# Altium project 线性稳压电源.PrjPCB
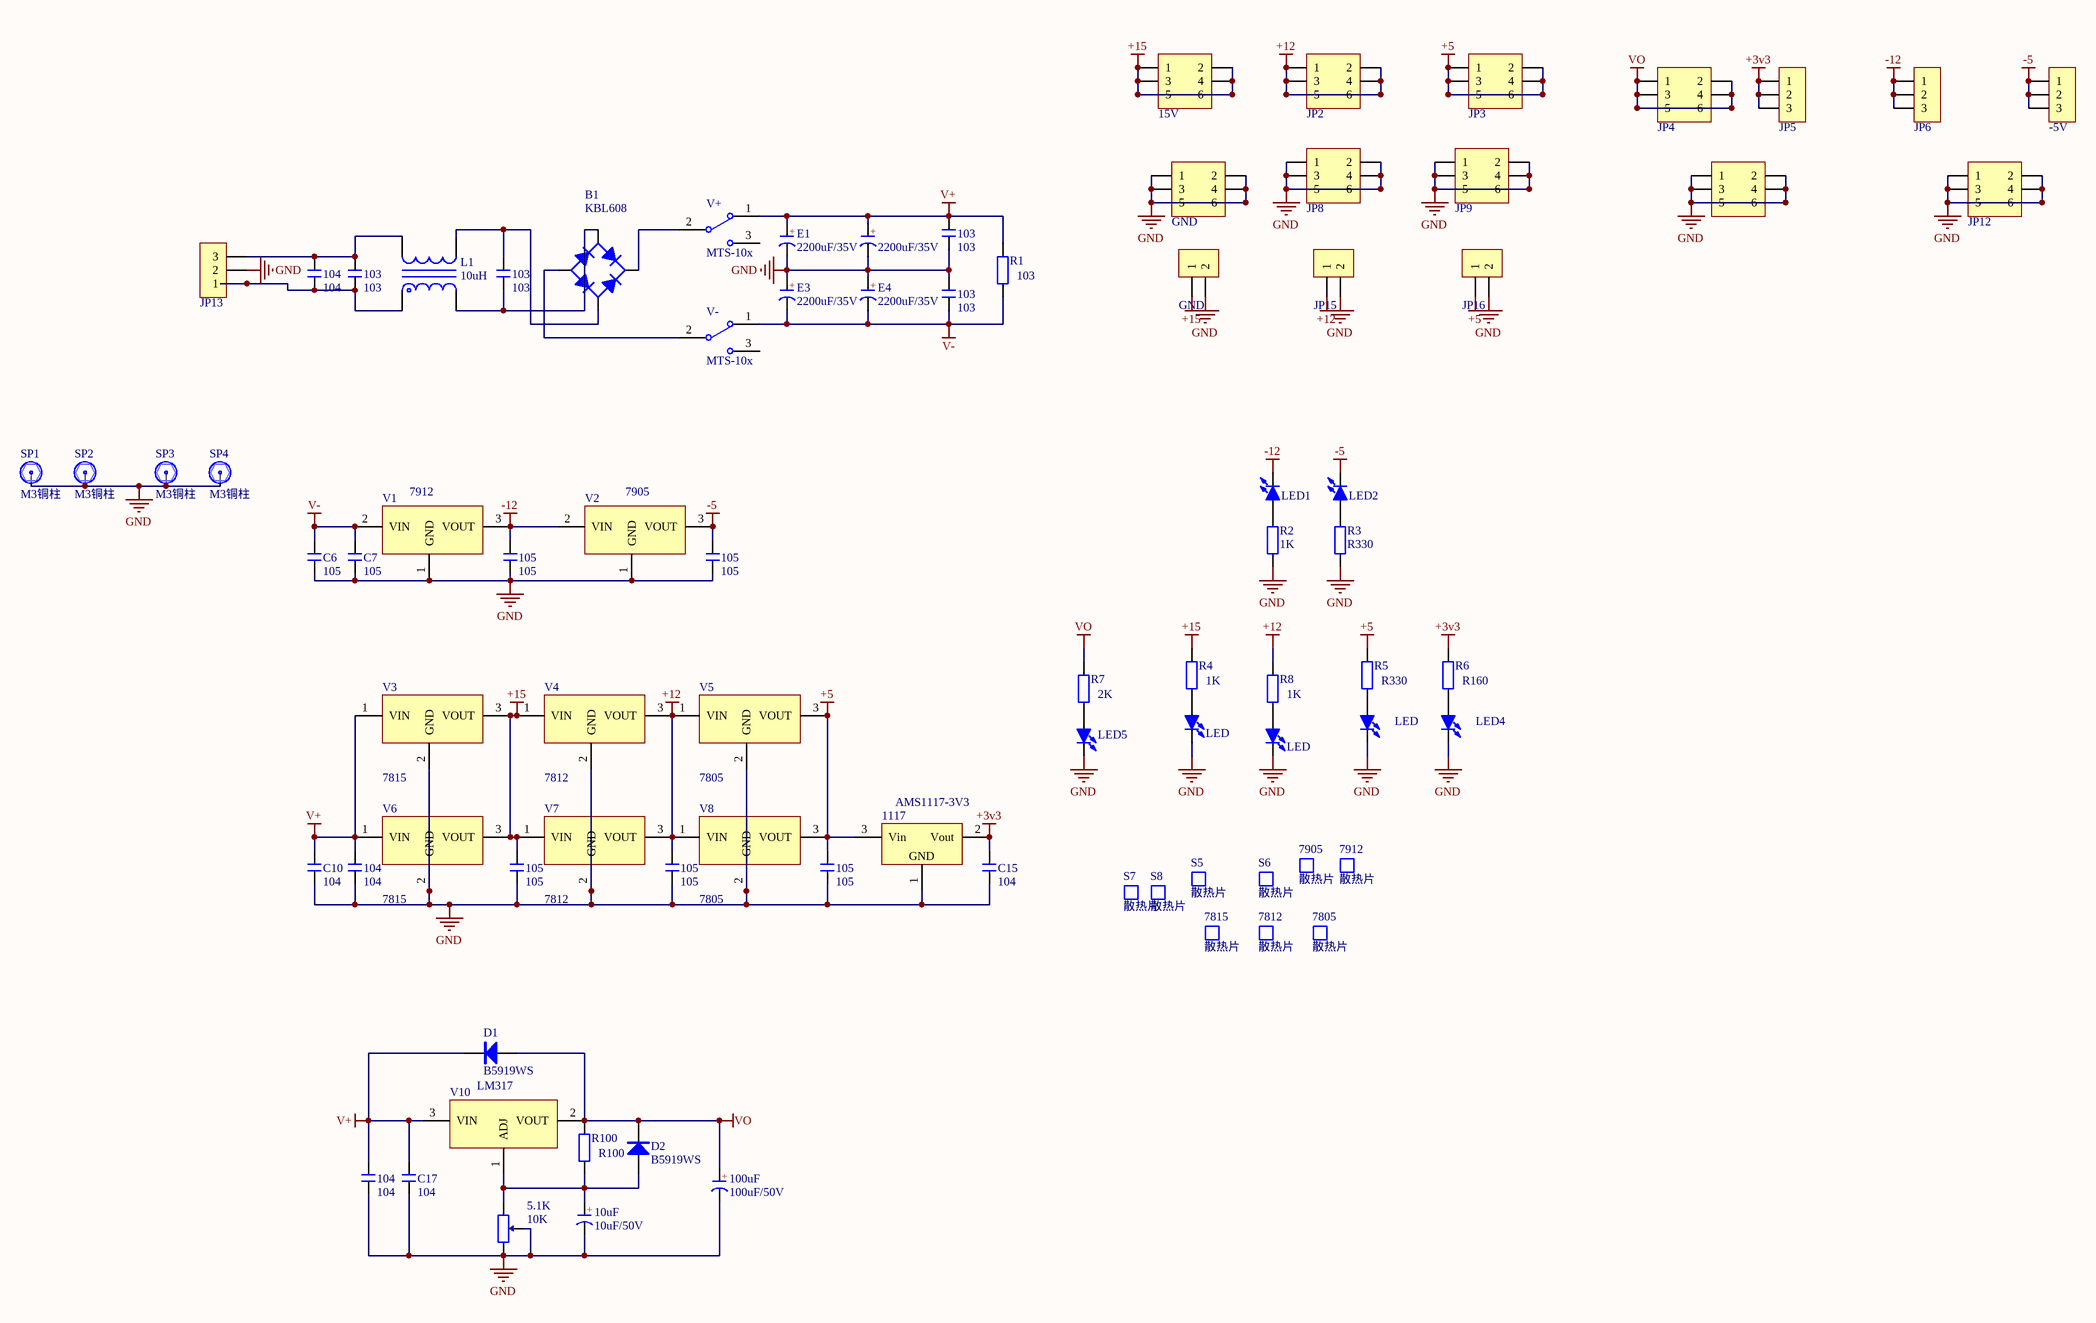
[diagram p0: 线性稳压电源.SchDoc]
1 sheet, 85 parts. Net scope: global (net labels, ports and power ports of the same name join across sheets).
Board file: 线性稳压电源.PcbDoc

## Sheet 线性稳压电源.SchDoc
size A2

### Parts
(Parts that share a designator on the sheet are numbered #1, #2 ... from top to bottom, then left to right.)
5.1K  10K  [3296W]
10uF  10uF/50V  [CAP 2.0*5*11 - BK]
15V  Header3X2  [HDR2.54-LI-2x3P]  (value not drawn)
100uF  100uF/50V  [CAP 3.5*8*11.5 - BK]
103#1  103  [C 0805_M]
103#2  103  [C 0805_M]
103#3  103  [C 0805_M]
103#4  103  [C 0805_M]
104#1  104  [C 0805_M]
104#2  104  [C 0805_M]
104#3  104  [C 0805_M]
105#1  105  [C 0805_M]
105#2  105  [C 0805_M]
105#3  105  [C 0805_M]
105#4  105  [C 0805_M]
105#5  105  [C 0805_M]
1117  AMS1117-3V3  [SOT223_N]
7805  散热片  [SRP10-15-25-P]
7812  散热片  [SRP10-15-25-P]
7815  散热片  [SRP10-15-25-P]
7905  散热片  [SRP10-15-25-P]
7912  散热片  [SRP10-15-25-P]
-5V  HDR-1X3  [HDR2.54-LI-3P]  (value not drawn)
?#1  (no value)  [HDR2.54-LI-2x3P]
?#2  2200uF/35V  [CAP 7.5*16*25 - GD]
B1  KBL608  [KBL]
C6  105  [C 0805_M]
C7  105  [C 0805_M]
C10  104  [C 0805_M]
C15  104  [C 0805_M]
C17  104  [C 0805_M]
D1  B5919WS  [SOD-323]
D2  B5919WS  [SOD-323]
E1  2200uF/35V  [CAP 7.5*16*25 - GD]
E3  2200uF/35V  [CAP 7.5*16*25 - GD]
E4  2200uF/35V  [CAP 7.5*16*25 - GD]
GND#1  Header3X2  [HDR2.54-LI-2x3P]  (value not drawn)
GND#2  HDR-1X2  [KF128-3.81-2P]  (value not drawn)
JP2  Header3X2  [HDR2.54-LI-2x3P]  (value not drawn)
JP3  Header3X2  [HDR2.54-LI-2x3P]  (value not drawn)
JP4  Header3X2  [HDR2.54-LI-2x3P]  (value not drawn)
JP5  HDR-1X3  [HDR2.54-LI-3P]  (value not drawn)
JP6  HDR-1X3  [HDR2.54-LI-3P]  (value not drawn)
JP8  Header3X2  [HDR2.54-LI-2x3P]  (value not drawn)
JP9  Header3X2  [HDR2.54-LI-2x3P]  (value not drawn)
JP12  Header3X2  [HDR2.54-LI-2x3P]  (value not drawn)
JP13  HDR-1X3  [KF2EDGK5.08-WI-3P]  (value not drawn)
JP15  HDR-1X2  [KF128-3.81-2P]  (value not drawn)
JP16  HDR-1X2  [KF128-3.81-2P]  (value not drawn)
L1  10uH  [UU10.5]
LED1  是的  [LED 0805G]  (value not drawn)
LED2  是的  [LED 0805G]  (value not drawn)
LED4  是的  [LED 0805G]  (value not drawn)
LED5  是的  [LED 0805G]  (value not drawn)
LED#1  是的  [LED 0805G]  (value not drawn)
LED#2  是的  [LED 0805G]  (value not drawn)
LED#3  是的  [LED 0805G]  (value not drawn)
R1  103  [R 0805_M]
R2  1K  [R 0805_M]
R3  R330  [R 0805_M]
R4  1K  [R 0805_M]
R5  R330  [R 0805_M]
R6  R160  [R 0805_M]
R7  2K  [R 0805_M]
R8  1K  [R 0805_M]
R100  R100  [R 0805_M]
S5  散热片  [SRP10-15-25-P]
S6  散热片  [SRP10-15-25-P]
S7  散热片  [SRP10-15-25-P]
S8  散热片  [SRP10-15-25-P]
SP1  M3铜柱  [M3x4_L]
SP2  M3铜柱  [M3x4_L]
SP3  M3铜柱  [M3x4_L]
SP4  M3铜柱  [M3x4_L]
V1  7912  [TO220A]
V2  7905  [TO220A]
V3  7815  [TO220A]
V4  7812  [TO220A]
V5  7805  [TO220A]
V6  7815  [TO220A]
V7  7812  [TO220A]
V8  7805  [TO220A]
V10  LM317  [TO220A]
V+  MTS-10x  [MTS-10x]
V-  MTS-10x  [MTS-10x]

### Nets
+3v3: 1117.2(Vout) C15.1 JP5.1 JP5.2 JP5.3 R6.2
+5: 105#5.1 1117.3(Vin) JP3.1 JP3.2 JP3.3 JP3.4 JP3.5 JP3.6 JP16.1 R5.2 V5.3(VOUT) V8.3(VOUT)
+12: 105#4.1 JP2.1 JP2.2 JP2.3 JP2.4 JP2.5 JP2.6 JP15.1 R8.2 V4.3(VOUT) V5.1(VIN) V7.3(VOUT) V8.1(VIN)
+15: 15V.1 15V.2 15V.3 15V.4 15V.5 15V.6 105#3.1 GND#2.1 R4.2 V3.3(VOUT) V4.1(VIN) V6.3(VOUT) V7.1(VIN)
-5: 105#2.1 -5V.1 -5V.2 -5V.3 LED2.2(K) V2.3(VOUT)
-12: 105#1.1 JP6.1 JP6.2 JP6.3 LED1.2(K) V1.3(VOUT) V2.2(VIN)
GND: 5.1K.2 5.1K.3 10uF.2(K) 100uF.2(K) 103#1.2 103#4.1 104#2.2 104#3.2 105#1.2 105#2.2 105#3.2 105#4.2 105#5.2 1117.1(GND) ?#1.1 ?#1.2 ?#1.3 ?#1.4 ?#1.5 ?#1.6 ?#2.2(K) C6.2 C7.2 C10.2 C15.2 C17.2 E1.2(K) E3.1(A) E4.1(A) GND#1.1 GND#1.2 GND#1.3 GND#1.4 GND#1.5 GND#1.6 GND#2.2 JP8.1 JP8.2 JP8.3 JP8.4 JP8.5 JP8.6 JP9.1 JP9.2 JP9.3 JP9.4 JP9.5 JP9.6 JP12.1 JP12.2 JP12.3 JP12.4 JP12.5 JP12.6 JP13.2 JP15.2 JP16.2 LED4.2(K) LED5.2(K) LED#1.2(K) LED#2.2(K) LED#3.2(K) R2.2 R3.2 SP1.1 SP2.1 SP3.1 SP4.1 V1.1(GND) V2.1(GND) V3.2(GND) V4.2(GND) V5.2(GND) V6.2(GND) V7.2(GND) V8.2(GND)
V+: 103#1.1 104#2.1 104#3.1 ?#2.1(A) C10.1 C17.1 D1.2(K) E1.1(A) R1.2 V3.1(VIN) V6.1(VIN) V10.3(VIN) V+.1
V-: 103#4.2 C6.1 C7.1 E3.2(K) E4.2(K) R1.1 V1.2(VIN) V-.1
VO: 100uF.1(A) D1.1(A) D2.2(K) JP4.1 JP4.2 JP4.3 JP4.4 JP4.5 JP4.6 R7.2 R100.2 V10.2(VOUT)
Net5.1K_1: 5.1K.1 10uF.1(A) D2.1(A) R100.1 V10.1(ADJ)
Net103#2_1: 103#2.1 104#1.1 JP13.3 L1.4
Net103#2_2: 103#2.2 104#1.2 JP13.1 L1.1
Net103#3_1: 103#3.1 B1.AC2 L1.3
Net103#3_2: 103#3.2 B1.AC1 L1.2
NetB1_DC+: B1.DC+ V+.2
NetB1_DC-: B1.DC- V-.2
NetLED1_1: LED1.1(A) R2.1
NetLED2_1: LED2.1(A) R3.1
NetLED4_1: LED4.1(A) R6.1
NetLED5_1: LED5.1(A) R7.1
NetLED#1_1: LED#1.1(A) R4.1
NetLED#2_1: LED#2.1(A) R5.1
NetLED#3_1: LED#3.1(A) R8.1

Not connected (* = marked no-connect by the designer): V+ 3; V- 3

### Notes on the sheet
- (in symbol C-CAP) +

### Library data of the parts
5.1K = RP-ID: 插件单联电位器; BOM名称: 插件电位器; 版权归属: 源创客; 学习资源: www.ooocke.com
10uF 100uF ?#2 E1 E3 E4 = C-CAP: 直插电解电容; 版权归属: 源创客; BOM名称: 直插电解电容; 学习资源: www.ooocke.com
15V ?#1 GND#1 JP2-JP4 JP8 JP9 JP12 = Header 3X2: 3*2P接插件; 版权归属: 源创客; BOM名称: 3*2P接插件; 学习资源: www.ooocke.com
103#1-103#4 104#1-104#3 105#1-105#5 C6 C7 C10 C15 C17 = C-CC: 直插瓷片电容; 版权归属: 源创客; BOM名称: 直插瓷片电容; 学习资源: www.ooocke.com
1117 = AMS1117: 三端稳压芯片; BOM名称: 稳压芯片; 版权归属: 源创客; 学习资源: www.ooocke.com
7805 7812 7815 7905 7912 S5-S8 = S1: 版权归属: 源创客; BOM名称: 散热片; 学习资源: www.ooocke.com
-5V JP5 JP6 JP13 = Header 3: 3P接插件; 版权归属: 源创客; BOM名称: 3P接插件; 学习资源: www.ooocke.com
B1 = KBL: 600V/8A整流桥; BOM名称: 1KV/2A整流桥; 版权归属: 源创客; 学习资源: www.ooocke.com
D1 D2 = 1N5819: 肖特基二极管; 版权归属: 源创客; 属性: 40V/2A; BOM名称: 肖特基二极管; 学习资源: www.ooocke.com
GND#2 JP15 JP16 = Header 2: 2P接插件; 版权归属: 源创客; BOM名称: 2P接插件; 学习资源: www.ooocke.com
L1 = L-CMC: 共模电感; 版权归属: 源创客; BOM名称: 共模电感; 学习资源: www.ooocke.com
LED1 LED2 LED4 LED5 LED#1-LED#3 = LED-SMD: 贴片LED; 版权归属: 源创客; BOM名称: 贴片LED; 学习资源: www.ooocke.com
R1-R8 R100 = R: 贴片电阻; 版权归属: 源创客; BOM名称: 贴片电阻; 学习资源: www.ooocke.com
SP1-SP4 = 铜柱小焊盘: 铜柱; 版权归属: 源创客; BOM名称: 铜柱; 学习资源: www.ooocke.com
V1 V2 = 79xx: 线性稳压芯片; 版权归属: 源创客; BOM名称: 线性稳压芯片; 学习资源: www.ooocke.com
V3-V8 = 78xx: 线性稳压芯片; 版权归属: 源创客; BOM名称: 线性稳压芯片; 学习资源: www.ooocke.com
V10 = LM317: 可调线性稳压芯片; 版权归属: 源创客; BOM名称: 可调线性稳压芯片; 学习资源: www.ooocke.com
V+ V- = MTS-10x: MTS10x系列3脚扭子开关; 版权归属: 源创客; BOM名称: MTS10x系列3脚扭子开关; 学习资源: www.ooocke.com